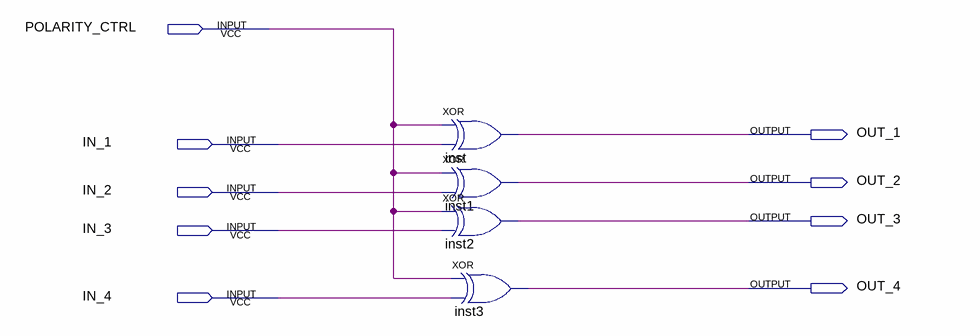
[diagram p0: schematic sheet]
// Quartus schematic polarity_ctrl.bdf as structural Verilog: 4 symbols, 9 pins
module polarity_ctrl (
  input  POLARITY_CTRL,
  input  IN_1,
  input  IN_2,
  input  IN_3,
  input  IN_4,
  output OUT_1,
  output OUT_2,
  output OUT_3,
  output OUT_4
);

  xor inst (OUT_1, POLARITY_CTRL, IN_1);
  xor inst1 (OUT_2, POLARITY_CTRL, IN_2);
  xor inst2 (OUT_3, POLARITY_CTRL, IN_3);
  xor inst3 (OUT_4, POLARITY_CTRL, IN_4);
endmodule
